# EAGLE design GPIO Protector with Console (EAGLE 7.4.0)
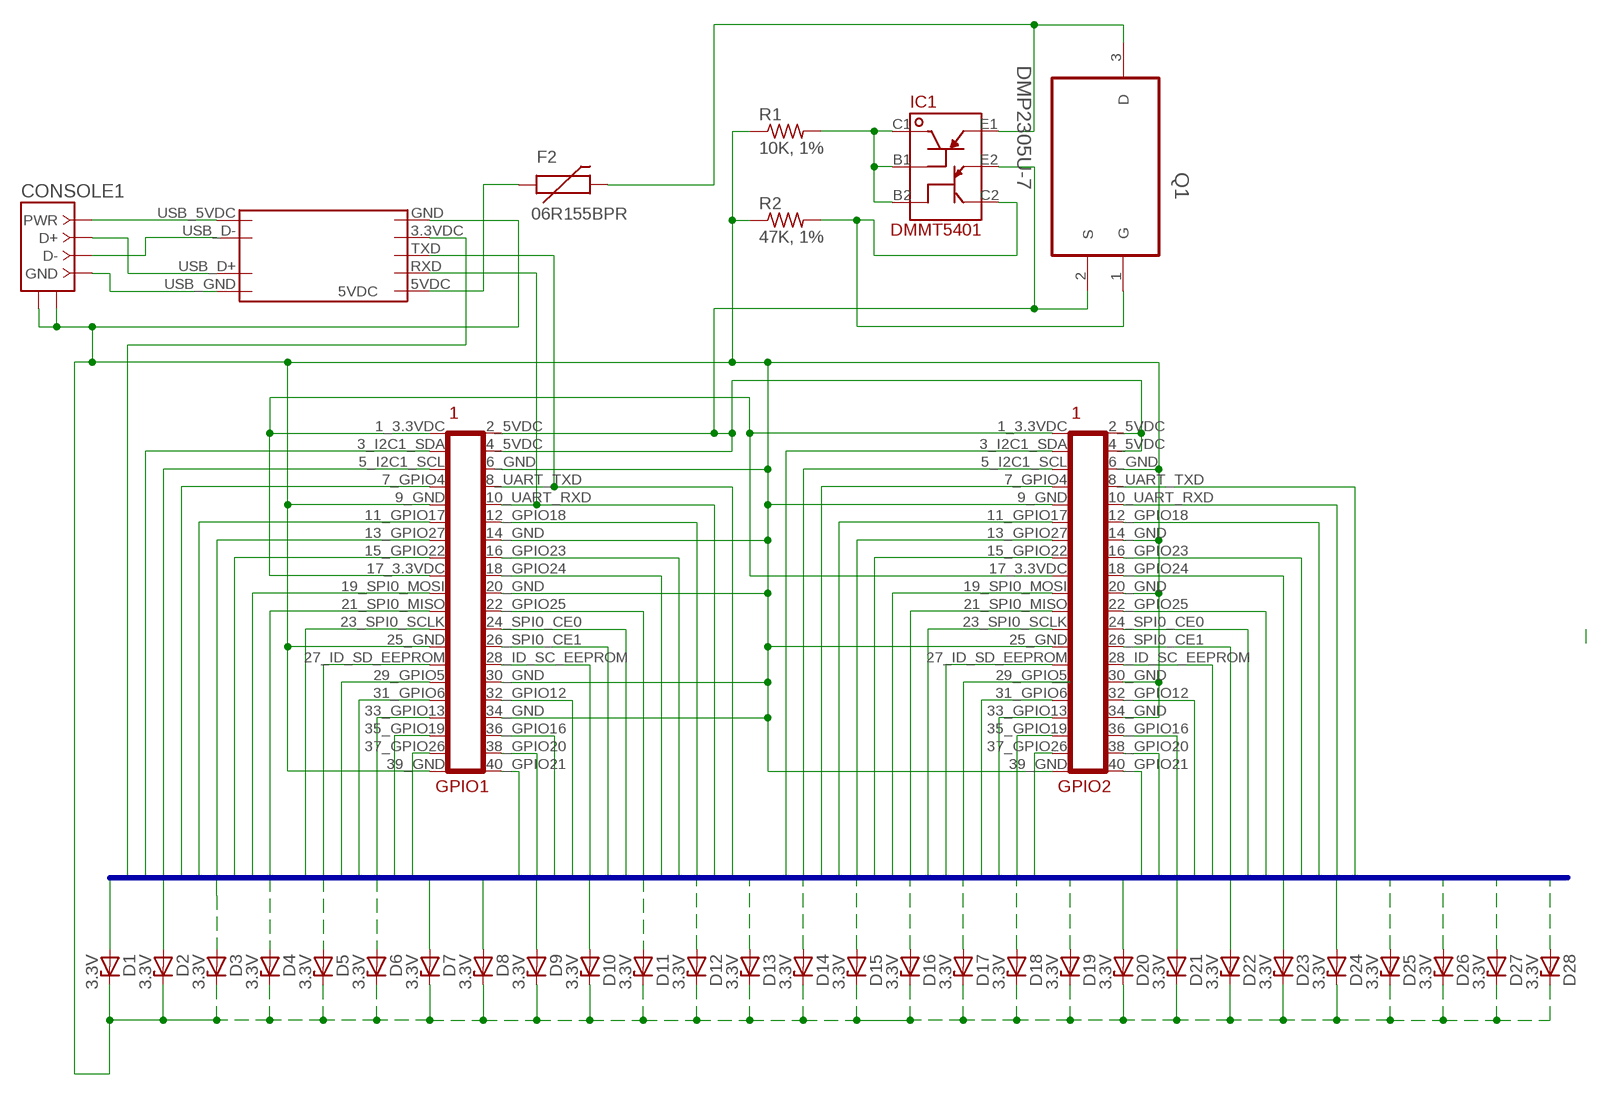
[diagram p0: schematic, sheet 1]

## Parts
CONSOLE1  USB-RA  [USBBF-1]
D1  3.3V  ZENER-DIODEDO41Z10  [DO41Z10]
D2  3.3V  ZENER-DIODEDO41Z10  [DO41Z10]
D3  3.3V  ZENER-DIODEDO41Z10  [DO41Z10]
D4  3.3V  ZENER-DIODEDO41Z10  [DO41Z10]
D5  3.3V  ZENER-DIODEDO41Z10  [DO41Z10]
D6  3.3V  ZENER-DIODEDO41Z10  [DO41Z10]
D7  3.3V  ZENER-DIODEDO41Z10  [DO41Z10]
D8  3.3V  ZENER-DIODEDO41Z10  [DO41Z10]
D9  3.3V  ZENER-DIODEDO41Z10  [DO41Z10]
D10  3.3V  ZENER-DIODEDO41Z10  [DO41Z10]
D11  3.3V  ZENER-DIODEDO41Z10  [DO41Z10]
D12  3.3V  ZENER-DIODEDO41Z10  [DO41Z10]
D13  3.3V  ZENER-DIODEDO41Z10  [DO41Z10]
D14  3.3V  ZENER-DIODEDO41Z10  [DO41Z10]
D15  3.3V  ZENER-DIODEDO41Z10  [DO41Z10]
D16  3.3V  ZENER-DIODEDO41Z10  [DO41Z10]
D17  3.3V  ZENER-DIODEDO41Z10  [DO41Z10]
D18  3.3V  ZENER-DIODEDO41Z10  [DO41Z10]
D19  3.3V  ZENER-DIODEDO41Z10  [DO41Z10]
D20  3.3V  ZENER-DIODEDO41Z10  [DO41Z10]
D21  3.3V  ZENER-DIODEDO41Z10  [DO41Z10]
D22  3.3V  ZENER-DIODEDO41Z10  [DO41Z10]
D23  3.3V  ZENER-DIODEDO41Z10  [DO41Z10]
D24  3.3V  ZENER-DIODEDO41Z10  [DO41Z10]
D25  3.3V  ZENER-DIODEDO41Z10  [DO41Z10]
D26  3.3V  ZENER-DIODEDO41Z10  [DO41Z10]
D27  3.3V  ZENER-DIODEDO41Z10  [DO41Z10]
D28  3.3V  ZENER-DIODEDO41Z10  [DO41Z10]
F2  06R155BPR  PTCPTH  [PTC]
GPIO1  RPI_GPIOUPPER  [RPI_GPIO_MALE]
GPIO2  RPI_GPIOUPPER  [RPI_GPIO_MALE]
IC1  DMMT5401  DMMT5401DMMT  [DMMT5401]
Q1  DMP2305U-7  [SOT103P240X110-3N]
R1  10K, 1%  R-US_0204/7  [0204/7]
R2  47K, 1%  R-US_0204/7  [0204/7]
UART1  GS27159  [GS27159]

## Nets
3.3VDC: GPIO1.1_3.3VDC GPIO1.17_3.3VDC GPIO2.1_3.3VDC GPIO2.17_3.3VDC
5VDC: GPIO1.2_5VDC GPIO1.4_5VDC GPIO2.2_5VDC GPIO2.4_5VDC IC1.E2 Q1.2(S)
5VDC_TO_FUSE: F2.P$1 UART1.5VDC
GND: CONSOLE1.CASE1(SHIELD1) CONSOLE1.CASE2(SHIELD2) D1.C D2.C D3.C D4.C D5.C D6.C D7.C D8.C D9.C D10.C D11.C D12.C D13.C D14.C D15.C D16.C D17.C D18.C D19.C D20.C D21.C D22.C D23.C D24.C D25.C D26.C D27.C D28.C GPIO1.6_GND GPIO1.9_GND GPIO1.14_GND GPIO1.20_GND GPIO1.25_GND GPIO1.30_GND GPIO1.34_GND GPIO1.39_GND GPIO2.6_GND GPIO2.9_GND GPIO2.14_GND GPIO2.20_GND GPIO2.25_GND GPIO2.30_GND GPIO2.34_GND GPIO2.39_GND R1.1 R2.1 UART1.GND
GPIO4: D3.A GPIO1.7_GPIO4 GPIO2.7_GPIO4
GPIO5: D11.A GPIO1.29_GPIO5
GPIO6: D12.A GPIO1.31_GPIO6 GPIO2.31_GPIO6
GPIO12: D25.A GPIO1.32_GPIO12 GPIO2.32_GPIO12
GPIO13: D13.A GPIO1.33_GPIO13 GPIO2.33_GPIO13
GPIO16: D26.A GPIO1.36_GPIO16 GPIO2.36_GPIO16 UART1.3.3VDC
GPIO17: D4.A GPIO1.11_GPIO17 GPIO2.11_GPIO17
GPIO18: D16.A GPIO1.12_GPIO18 GPIO2.12_GPIO18
GPIO19: D14.A GPIO1.35_GPIO19 GPIO2.35_GPIO19
GPIO20: D27.A GPIO1.38_GPIO20 GPIO2.38_GPIO20
GPIO21: D28.A GPIO1.40_GPIO21 GPIO2.40_GPIO21
GPIO22: D6.A GPIO1.15_GPIO22 GPIO2.15_GPIO22
GPIO23: D17.A GPIO1.16_GPIO23 GPIO2.16_GPIO23
GPIO24: D18.A GPIO1.18_GPIO24 GPIO2.18_GPIO24
GPIO25: D19.A GPIO1.22_GPIO25 GPIO2.22_GPIO25
GPIO26: D15.A GPIO1.37_GPIO26 GPIO2.37_GPIO26
GPIO27: D5.A GPIO1.13_GPIO27 GPIO2.13_GPIO27
I2C_SCL: D2.A GPIO1.5_I2C1_SCL GPIO2.5_I2C1_SCL
I2C_SDA: D1.A GPIO1.3_I2C1_SDA GPIO2.3_I2C1_SDA
ID_SC: D24.A GPIO1.28_ID_SC_EEPROM GPIO2.28_ID_SC_EEPROM
ID_SD: D10.A GPIO1.27_ID_SD_EEPROM(27_ID_SC_EEPROM) GPIO2.27_ID_SD_EEPROM(27_ID_SC_EEPROM)
IN: F2.P$2 IC1.E1 Q1.3(D)
N$2: IC1.B1 IC1.B2 IC1.C1 R1.2
N$3: IC1.C2 Q1.1(G) R2.2
N$14: CONSOLE1.4(GND) UART1.USB_GND
N$15: CONSOLE1.1(PWR) UART1.USB_5VDC
N$16: CONSOLE1.2(D-) UART1.USB_D-
N$17: CONSOLE1.3(D+) UART1.USB_D+
SPI_CE0: D22.A GPIO1.24_SPI0_CE0 GPIO2.24_SPI0_CE0
SPI_CE1: D23.A GPIO1.26_SPI0_CE1 GPIO2.26_SPI0_CE1
SPI_MISO: D8.A GPIO1.21_SPI0_MISO GPIO2.21_SPI0_MISO
SPI_MOSI: D7.A GPIO1.19_SPI0_MOSI GPIO2.19_SPI0_MOSI
SPI_SCLK: D9.A GPIO1.23_SPI0_SCLK GPIO2.23_SPI0_SCLK
UART_RXD: D21.A GPIO1.10_UART_RXD(10_UART0_RXD) GPIO2.10_UART_RXD(10_UART0_RXD) UART1.RXD
UART_TXD: D20.A GPIO1.8_UART_TXD(8_UART0_TXD) GPIO2.8_UART_TXD(8_UART0_TXD) UART1.TXD
Unconnected: GPIO2.29_GPIO5

## Buses
GPIO4,GPIO5,GPIO6,GPIO12,GPIO13,GPIO14,GPIO16,GPIO17,GPIO18,GPIO19,GPIO20,GPIO21,GPIO22,GPIO23,GPIO24,GPIO25,GPIO26,GPIO27,ID_SC,ID_SD,I2C_SCL,I2C_SDA,SPI_CE0,SPI_CE1,SPI_MISO,SPI_MOSI,SPI_SCLK,UART_RXD,UART_TXD

## Library data of the parts
CONSOLE1 = connector:USB-R: USB connector, 2 shield pins; DESC: USB B socket; SUPPLIER: Jameco: 230958; VALSTAT: label
D1-D28 = diode:ZENER-DIODE: Z-Diode
F2 = SparkFun-PowerIC:PTC: Resettable Fuse PTC Resettable Fuse. Spark Fun Electronics SKU : COM-08357
GPIO1 GPIO2 = connectors:RPI_GPIO*: GPIO Connector for Raspberry Pi.
IC1 = Diodes_Inc_By_element14_Batch_1:DMMT5401
Q1 = Diodes_Inc_By_element14_Batch_1:DMP2305U-7: P-CHANNEL ENHANCEMENT MODE MOSFET; MPN: DMP2305U-7; OC_FARNELL: 1858668; OC_NEWARK: 23T5607; PACKAGE: SOT-23-3; SUPPLIER: DIODES INC.
R1 R2 = resistor:R-US_: RESISTOR, American symbol
UART1 = packages:GS27159: From JBTek USB to Console Cable Board: TTD-C GS27159

## Board
GPIO Protect & Split Splits the GPIO connection into two connectors, while adding protection to IO circuits so they can only take 3.3VDC and no more. All extra power gets grounded. Mounting The assembly is made to mount underneat the RPi, with the single GPIO connector hanging out. Tall enough standoffs should be used to allow connection to both connectors underneath it.
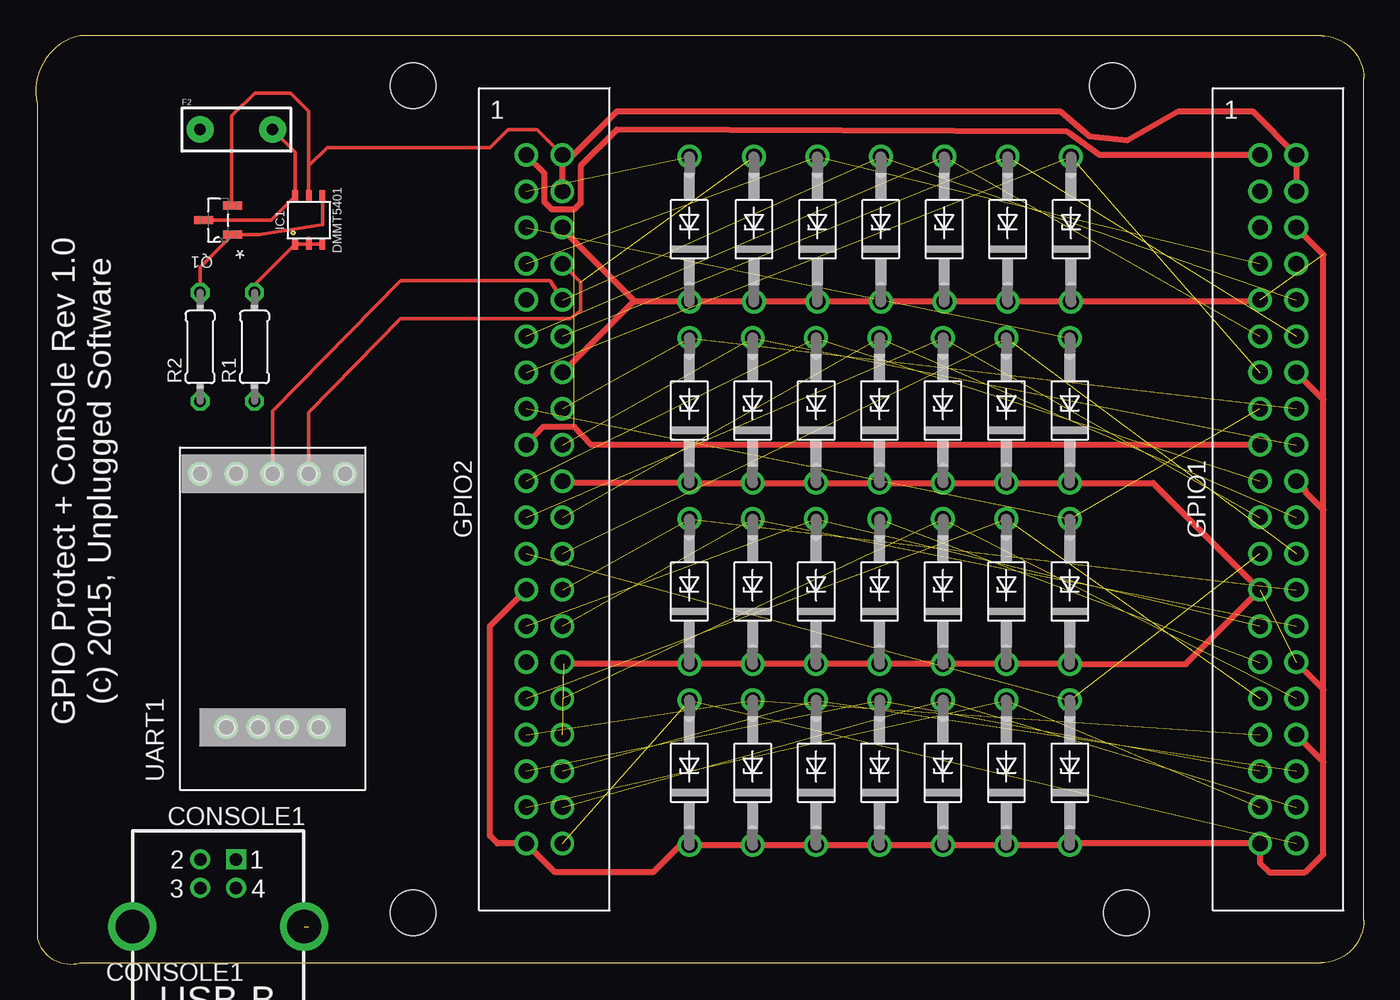
[diagram p1: board, top side]
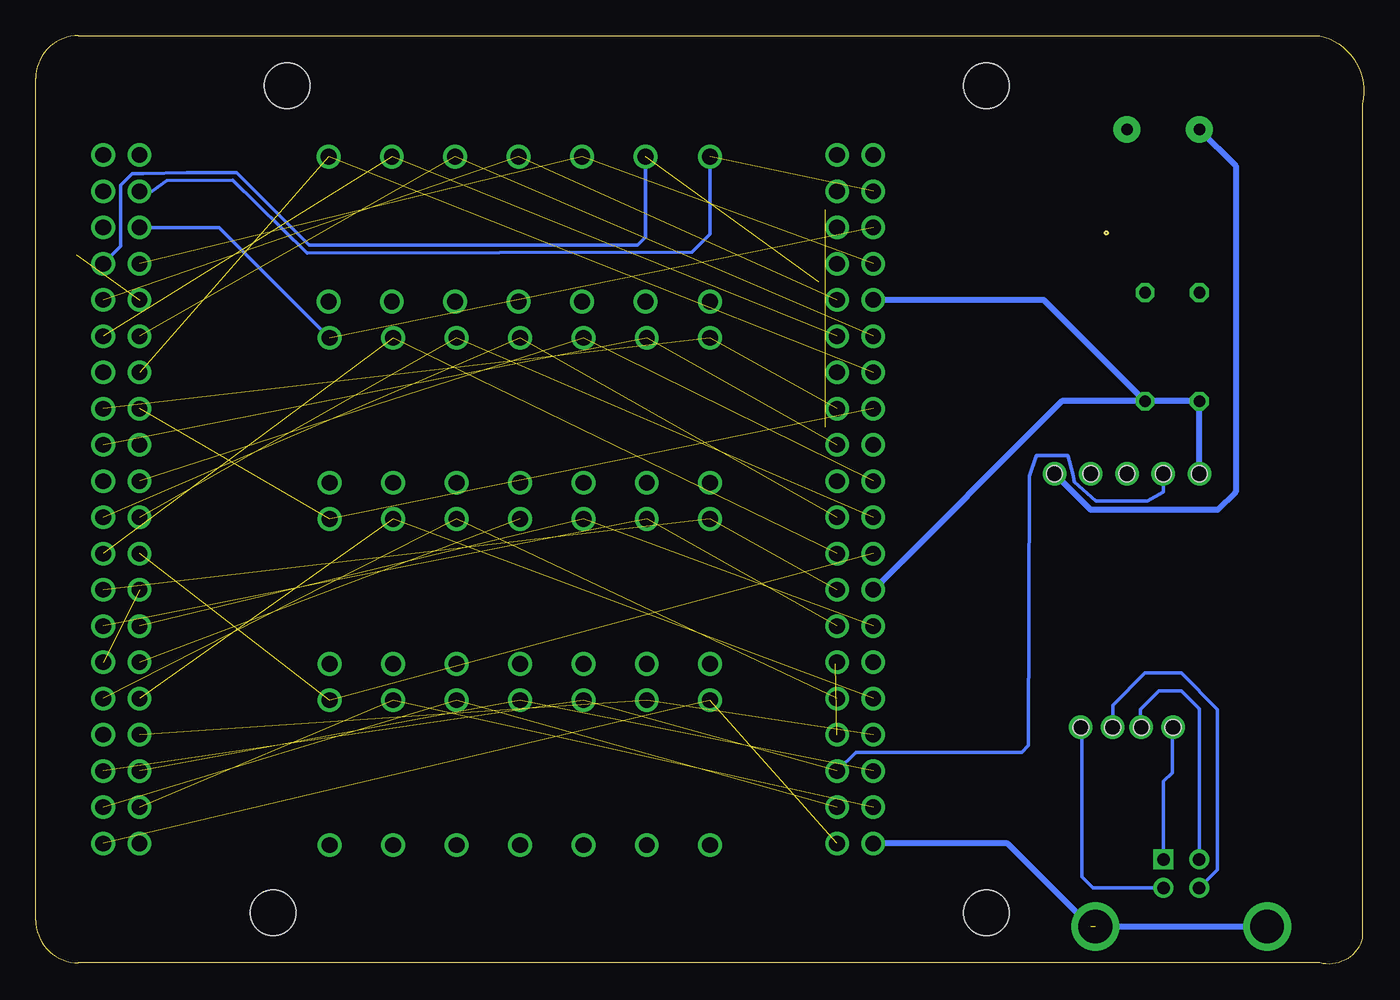
[diagram p2: board, bottom side, seen from below]

Size 93.1 x 65.08 mm. Coordinates in mm from the lower left corner, seen from the top.
Outline: 3.1,0.08 90.1,0.08 arc90 93.1,3.08 93.1,62.08 arc90 90.1,65.08 3.1,65.08 arc90 0.1,60.31 0.1,1.81 arc90 3.1,0.08
Copper layers (1*16): Top 0.035mm / dielectric 1.5mm / Bottom 0.035mm
Design rules "default *": minimum track width 10mil, minimum drill 24mil, track to track 8mil, track to pad 8mil, pad to pad 8mil, via to via 8mil, smd to smd 8mil, copper to edge 40mil, drill to drill 8mil, minimum pad ring 10mil, minimum via ring 8mil, stop-mask expansion 4mil, vias tented up to drill 0mil, thermal gap 10mil
Holes 3.2 mm at 26.46,3.58 76.46,3.58 75.46,61.58 26.46,61.58

### Footprints (pad centres in the part's own frame; a part is rotated, then mirrored left to right if it is on the bottom)
USBBF-1 = drill 0.889 pad 1.321 square: 1 -1.25,-4.71 | drill 0.889 pad 1.321: 2 1.25,-4.71; 3 1.25,-2.71; 4 -1.25,-2.71 | drill 2.362 pad 3.175: CASE1 -6.02,0; CASE2 6.02,0
DO41Z10 = drill 1.118: A 5.08,0; C -5.08,0
PTC = drill 0.8 pad 1.88: P$1 -2.54,0; P$2 2.54,0
RPI_GPIO_MALE = drill 1.1: 1_3.3VDC -1.27,24.13; 2_5VDC 1.27,24.13; 3_I2C1_SDA -1.27,21.59; 4_5VDC 1.27,21.59; 5_I2C1_SCL -1.27,19.05; 6_GND 1.27,19.05; 7_GPIO4 -1.27,16.51; 8_UART_TXD 1.27,16.51; 9_GND -1.27,13.97; 10_UART_RXD 1.27,13.97; 11_GPIO17 -1.27,11.43; 12_GPIO18 1.27,11.43; 13_GPIO27 -1.27,8.89; 14_GND 1.27,8.89; 15_GPIO22 -1.27,6.35; 16_GPIO23 1.27,6.35; 17_3.3VDC -1.27,3.81; 18_GPIO24 1.27,3.81; 19_SPI0_MOSI -1.27,1.27; 20_GND 1.27,1.27; 21_SPI0_MISO -1.27,-1.27; 22_GPIO25 1.27,-1.27; 23_SPI0_SCLK -1.27,-3.81; 24_SPI0_CE0 1.27,-3.81; 25_GND -1.27,-6.35; 26_SPI0_CE1 1.27,-6.35; 27_ID_SD_EEPROM -1.27,-8.89; 28_ID_SC_EEPROM 1.27,-8.89; 29_GPIO5 -1.27,-11.43; 30_GND 1.27,-11.43; 31_GPIO6 -1.27,-13.97; 32_GPIO12 1.27,-13.97; 33_GPIO13 -1.27,-16.51; 34_GND 1.27,-16.51; 35_GPIO19 -1.27,-19.05; 36_GPIO16 1.27,-19.05; 37_GPIO26 -1.27,-21.59; 38_GPIO20 1.27,-21.59; 39_GND -1.27,-24.13; 40_GPIO21 1.27,-24.13
DMMT5401 = smd 0.406 x 0.813: B1 0,-1.676; B2 0.95,-1.676; C1 -0.95,-1.676; C2 0.95,1.676; E1 -0.95,1.676; E2 0,1.676
SOT103P240X110-3N = smd 1.321 x 0.559: 1 -1.016,1.016; 2 -1.016,-1.016; 3 1.016,0
0204/7 = drill 0.813 octagon: 1 -3.81,0; 2 3.81,0
GS27159 = drill 1.1: 3.3VDC -2.54,10.16; 5VDC 5.08,10.16; GND -5.08,10.16; RXD 0,10.16; TXD 2.54,10.16; USB_5VDC -3.24,-7.62; USB_D+ 1,-7.62; USB_D- -1,-7.62; USB_GND 3.24,-7.62 | hole 1.1: 1,-7.62; 3.24,-7.62; -1,-7.62; -3.24,-7.62; -5.08,10.16; -2.54,10.16; 0,10.16; 2.54,10.16; 5.08,10.16

### Placement (x,y rotation side)
CONSOLE1  12.8,2.62 180 top
D1  45.82,51.52 90 top
D2  72.49,38.82 90 top
D3  54.79,51.52 90 top
D4  63.68,51.52 90 top
D5  72.57,51.52 90 top
D6  72.49,26.12 90 top
D7  54.71,38.82 90 top
D8  63.6,38.82 90 top
D9  72.49,13.42 90 top
D10  54.71,26.12 90 top
D11  59.15,26.12 90 top
D12  68.04,26.12 90 top
D13  50.26,13.42 90 top
D14  59.15,13.42 90 top
D15  68.04,13.42 90 top
D16  68.13,51.52 90 top
D17  45.82,38.82 90 top
D18  50.26,38.82 90 top
D19  59.15,38.82 90 top
D20  50.35,51.52 90 top
D21  59.24,51.52 90 top
D22  68.04,38.82 90 top
D23  45.82,26.12 90 top
D24  50.26,26.12 90 top
D25  63.6,26.12 90 top
D26  54.71,13.42 90 top
D27  63.6,13.42 90 top
D28  45.82,13.42 90 top
F2  14.07,58.5 0 top
GPIO1  87.09,32.58 0 top
GPIO2  35.66,32.58 0 top
IC1  19.15,52.15 0 top
Q1  12.8,52.15 180 top
R1  15.34,43.26 90 top
R2  11.53,43.26 90 top
UART1  16.61,24.21 0 top

### Tracks (layer width: path | path; a pad name or v marks a point on that pad's centre or on a via)
3.3VDC  (1 unrouted)
  Top 0.406: GPIO1.1_3.3VDC 74.59,56.71 72.33,58.35 40.74,58.5 38.2,55.96 38.2,53.34 37.75,52.9 36.18,52.9 35.66,53.42 35.66,55.44 GPIO2.1_3.3VDC | GPIO1.17_3.3VDC 38.94,36.39 37.75,37.66 35.58,37.66 GPIO2.17_3.3VDC
5VDC
  Top 0.254: Q1.2 13.75,53.23 13.75,59.46 15.34,61.04 17.88,61.04 19.15,59.77 IC1.E2 19.15,55.96 20.42,57.23 31.85,57.23 33.12,58.5 35.14,58.5 GPIO2.2_5VDC
  Top 0.406: GPIO2.4_5VDC GPIO2.2_5VDC 37.68,56.71 40.74,59.77 71.81,59.77 73.85,58.05 76.51,57.74 80.11,59.77 85.3,59.77 GPIO1.2_5VDC GPIO1.4_5VDC
5VDC_TO_FUSE
  Bottom 0.406: F2.P$1 8.99,55.96 8.99,33.1 10.26,31.83 19.15,31.83 UART1.5VDC
GND  (4 unrouted)
  Top 0.406: GPIO2.30_GND 37.04,21.04 D23.C D24.C D10.C D11.C D25.C D12.C D6.C 80.63,21.04 GPIO1.25_GND 78.32,33.74 D2.C D22.C D8.C D19.C D7.C D18.C D17.C 37.04,33.74 GPIO2.20_GND | GPIO2.14_GND 41.89,46.44 42.01,46.44 | 42.01,46.44 D1.C D20.C D3.C D21.C D4.C D16.C D5.C 85.82,46.44 GPIO1.9_GND | GPIO2.6_GND 36.93,51.52 42.01,46.44 | GPIO2.25_GND 31.85,23.69 31.85,8.97 32.37,8.45 GPIO2.39_GND 36.41,6.43 43.28,6.43 45.18,8.34 D28.C D13.C D26.C D14.C D27.C D15.C D9.C 72.6,8.45 GPIO1.39_GND 85.82,7.07 86.46,6.43 89,6.43 90.27,7.7 90.27,14.17 | 90.27,14.17 GPIO1.34_GND | 90.27,14.17 90.27,19.25 | 90.27,19.25 GPIO1.30_GND | 90.27,19.25 90.27,31.83 | 90.27,31.83 89,33.1 89,33.22 GPIO1.20_GND | 90.27,31.83 90.27,39.57 | 90.27,39.57 GPIO1.14_GND | 90.27,39.57 90.27,49.73 GPIO1.6_GND
  Bottom 0.406: CONSOLE1.CASE2 19.15,2.62 24.98,8.45 GPIO2.39_GND | UART1.GND R2.1 R1.1 | R1.1 22.44,46.55 GPIO2.9_GND | R1.1 21.17,39.45 GPIO2.25_GND
GPIO4  (2 unrouted)
GPIO5  (1 unrouted)
GPIO6  (2 unrouted)
GPIO12  (2 unrouted)
GPIO13  (2 unrouted)
GPIO16  (2 unrouted)
  Bottom 0.254: UART1.3.3VDC 14.07,33.1 15.18,32.47 18.8,32.47 20.3,33.79 20.38,34.34 20.75,35.64 22.96,35.64 23.45,34.22 23.51,15.32 23.98,14.84 35.62,14.84 GPIO2.36_GPIO16
GPIO17  (2 unrouted)
GPIO18  (2 unrouted)
GPIO19  (2 unrouted)
GPIO20  (2 unrouted)
GPIO21  (2 unrouted)
GPIO22  (2 unrouted)
GPIO23  (2 unrouted)
GPIO24  (2 unrouted)
GPIO25  (2 unrouted)
GPIO26  (2 unrouted)
GPIO27  (2 unrouted)
I2C_SCL  (1 unrouted)
  Bottom 0.254: GPIO1.5_I2C1_SCL 80.22,51.63 D2.A
I2C_SDA  (1 unrouted)
  Bottom 0.254: GPIO1.3_I2C1_SDA 84.91,54.17 83.92,54.93 79.27,54.95 74.07,49.83 47.09,49.91 45.82,51.18 D1.A
ID_SC  (2 unrouted)
ID_SD  (2 unrouted)
IN
  Top 0.254: F2.P$2 18.2,56.91 IC1.E1 16.52,52.15 Q1.3
N$2
  Top 0.254: R1.2 15.34,47.62 IC1.C1 IC1.B1 | IC1.B1 19.15,50.88 | IC1.B1 IC1.B2
N$3
  Top 0.254: R2.2 11.53,48.85 Q1.1 15.65,51.14 20.1,51.84 IC1.C2
N$14
  Bottom 0.254: CONSOLE1.4 19,5.33 19.78,6.12 19.78,16.53 UART1.USB_GND
N$15
  Bottom 0.254: CONSOLE1.1 14.05,12.8 13.43,13.42 13.43,16.53 UART1.USB_5VDC
N$16
  Bottom 0.254: CONSOLE1.2 11.55,17.88 12.8,19.13 14.38,19.13 15.65,17.86 15.65,16.64 UART1.USB_D-
N$17
  Bottom 0.254: CONSOLE1.3 10.26,6.62 10.26,17.86 12.8,20.4 15.34,20.4 17.61,18.13 UART1.USB_D+
SPI_CE0  (2 unrouted)
SPI_CE1  (2 unrouted)
SPI_MISO  (2 unrouted)
SPI_MOSI  (2 unrouted)
SPI_SCLK  (2 unrouted)
UART_RXD  (2 unrouted)
  Top 0.254: UART1.RXD 16.61,38.78 25.57,47.9 36.05,47.9 GPIO2.10_UART_RXD
UART_TXD  (1 unrouted)
  Top 0.254: UART1.TXD 19.15,38.66 25.57,45.24 37.48,45.24 38.2,45.8 38.2,47.82 GPIO2.8_UART_TXD
  Bottom 0.254: D20.A 50.35,50.94 50.9,50.39 73.91,50.39 78.99,55.47 82.52,55.47 85.57,55.4 86.35,55.4 87.13,54.61 87.13,50.33 GPIO1.8_UART_TXD

### Text on the board
tNames: GPIO Protect + Console Rev 1.0 / (c) 2015, Unplugged Software